# Altium schematic sheet ShuntAmplifier.SchDoc
size A4
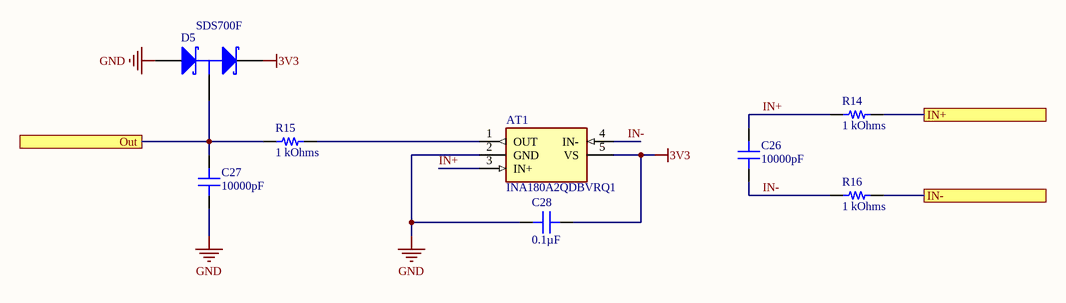
[diagram p0: ShuntAmplifier.SchDoc]

## Parts
AT1  INA180A2QDBVRQ1  [SOT95P280X145-5N]
C26  10000pF  [CAP 0805_2012]
C27  10000pF  [CAP 0805_2012]
C28  0.1µF  [CAP 0805_2012]
D5  SDS700F  [SOT323_N]
R14  1 kOhms  [RES 0805_2012]
R15  1 kOhms  [RES 0805_2012]
R16  1 kOhms  [RES 0805_2012]

## Ports
IN+, IN-, Out

## Nets
3V3: AT1.5(VS) C28.1 D5.2(K)
GND: AT1.2(GND) C27.1 C28.2 D5.1(A)
IN+: AT1.3(IN+) C26.2 R14.2
IN+: R14.1 ; port IN+  [a separate net that carries the same name]
IN-: AT1.4(IN-) C26.1 R16.2
IN-: R16.1 ; port IN-  [a separate net that carries the same name]
Out: C27.2 D5.3(C) R15.2 ; port Out
NetAT1_1: AT1.1(OUT) R15.1

## Library data of the parts
AT1 = INA180A2QDBVRQ1: Attenuator or Isolator; Manufacturer_Name: Texas Instruments; Datasheet Link: http://www.ti.com/lit/gpn/INA180-Q1; Height: 1.45mm; Manufacturer_Part_Number: INA180A2QDBVRQ1; Mouser Part Number: 595-INA180A2QDBVRQ1; Mouser Price/Stock: https://www.mouser.co.uk/ProductDetail/Texas-Instruments/INA180A2QDBVRQ1?qs=9r4v7xj2LnnPs8OEye75UA%3D%3D; Arrow Part Number: INA180A2QDBVRQ1; Arrow Price/Stock: https://www.arrow.com/en/products/ina180a2qdbvrq1/texas-instruments
C26 C27 = C0805C103KCRACAUTO: CAP CER 0805 10NF 500V X7R 10%; Manufacturer: KEMET; Part Number: C0805C103KCRACAUTO; Value: 10000pF; Applications: Automotive, Bypass, Decoupling; Capacitance: 10000pF; ComponentLink1Description: Datasheet; ComponentLink1URL: https://api.kemet.com/component-edge/download/datasheet/C0805C103KCRACAUTO.pdf; ComponentLink2Description: DigiKey Link; ComponentLink2URL: http://digikey.com/product-detail/en/kemet/C0805C103KCRACAUTO/399-16644-1-ND/8110010; Device Package: 0805 (2012 Metric); Features: Low ESL, High Voltage; LastUpdated: 02.09.2020 01:04:20; Lifecycle Status: Active; Minimum Order: 1; Mounting Type: Surface Mount, MLCC; Operating Temperature: -55°C ~ 125°C; Package / Case: 0805 (2012 Metric); Packaging: TapeAndReel; PartId: 14123; Part Status: Active; Price: 0.06; Ratings: AEC-Q200; Series: SMD Auto X7R HV; Size / Dimension: 0.079" L x 0.049" W (2.00mm x 1.25mm); Supplier 1: DigiKey; Supplier Part Number 1: 399-16644-1-ND; Temperature Coefficient: X7R; Thickness (Max): 0.055" (1.40mm); Tolerance: ±10%; Voltage - Rated: 500V
C28 = CC0805MRX7R9BB104: CAP CER 0.1UF 50V X7R 0805; Manufacturer: Yageo; Tolerance: ±20%; Part Number: CC0805MRX7R9BB104; Value: 0.1µF; Applications: General Purpose; Capacitance: 0.1µF; ComponentLink1Description: Datasheet; ComponentLink1URL: https://www.yageo.com/upload/media/product/productsearch/datasheet/mlcc/UPY-GPHC_X7R_6.3V-to-50V_18.pdf; ComponentLink2Description: DigiKey Link; ComponentLink2URL: http://digikey.com/product-detail/en/yageo/CC0805MRX7R9BB104/311-4351-1-ND/8025440; Device Package: 0805 (2012 Metric); LastUpdated: 02.09.2020 01:04:42; Lifecycle Status: Active; Minimum Order: 1; Mounting Type: Surface Mount, MLCC; Operating Temperature: -55°C ~ 125°C; Package / Case: 0805 (2012 Metric); Packaging: TapeAndReel; PartId: 2475; Part Status: Active; Price: 0.02; Series: CC; Size / Dimension: 0.079" L x 0.049" W (2.00mm x 1.25mm); Supplier 1: DigiKey; Supplier Part Number 1: 311-4351-1-ND; Temperature Coefficient: X7R; Thickness (Max): 0.037" (0.95mm); Voltage - Rated: 50V
D5 = BAT854SW: Schottky Barrier Double Diode; Published: 17-Sep-2003; LatestRevisionDate: 12-Dec-2006; LatestRevisionNote: IPC-7351 Footprint Added.; DatasheetVersion: 27-Feb-2001; PackageVersion: Apr-1999; PackageReference: SOT323; Publisher: Altium Limited; PackageDescription: 3-Pin SOT-323 Package 0.65 mm Pitch, 2.1 mm Lead Span; ComponentLink1Description: Manufacturer Link; ComponentLink1URL: http://www.semiconductors.philips.com/; ComponentLink2Description: Datasheet; ComponentLink2URL: http://www.semiconductors.philips.com/acrobat/datasheets/BAT854W_SERIES_1.pdf
R14-R16 = ESR10EZPF1001: RES SMD 1K OHM 1% 0.4W 0805; Manufacturer: Rohm Semiconductor; Power (Watts): 0.4W, 2/5W; Temperature Coefficient: ±100ppm/°C; Part Number: ESR10EZPF1001; Value: 1 kOhms; ComponentLink1Description: Datasheet; ComponentLink1URL: https://www.rohm.com/datasheet/ESR01MZPF/esr-e; ComponentLink2Description: DigiKey Link; ComponentLink2URL: http://digikey.com/product-detail/en/rohm-semiconductor/ESR10EZPF1001/RHM1.00KAECT-ND/1983804; Composition: Thick Film; Device Package: 0805 (2012 Metric); Features: Automotive AEC-Q200, Pulse Withstanding; Height - Seated (Max): 0.026" (0.65mm); LastUpdated: 02.09.2020 01:15:23; Lifecycle Status: Active; Minimum Order: 1; Number of Terminations: 2; Operating Temperature: -55°C ~ 155°C; Package / Case: 0805 (2012 Metric); Packaging: TapeAndReel; PartId: 28032; Part Status: Active; Price: 0.02; Ratings: AEC-Q200; Resistance: 1 kOhms; Series: ESR; Size / Dimension: 0.079" L x 0.049" W (2.00mm x 1.25mm); Supplier 1: DigiKey; Supplier Part Number 1: RHM1.00KAECT-ND; Supplier Device Package: 0805; Tolerance: ±1%